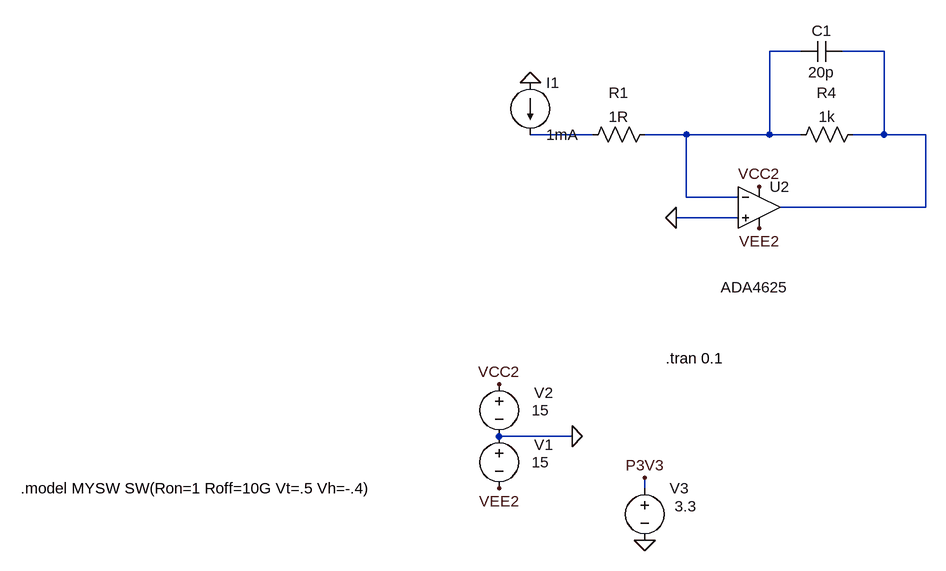
[diagram p0: schematic Draft20.asc]
Draft20.asc, the LTspice schematic file:
Version 4
SHEET 1 1768 872
WIRE 480 -112 432 -112
WIRE 608 -112 544 -112
WIRE 160 16 64 16
WIRE 304 16 240 16
WIRE 432 16 432 -112
WIRE 432 16 304 16
WIRE 480 16 432 16
WIRE 608 16 608 -112
WIRE 608 16 560 16
WIRE 672 16 608 16
WIRE 304 112 304 16
WIRE 384 112 304 112
WIRE 672 128 672 16
WIRE 672 128 448 128
WIRE 384 144 288 144
WIRE 128 480 16 480
WIRE 240 560 240 544
FLAG 128 480 0
FLAG 16 560 VEE2
FLAG 16 400 VCC2
FLAG 416 160 VEE2
FLAG 416 96 VCC2
FLAG 240 640 0
FLAG 240 544 P3V3
FLAG 64 -64 0
FLAG 288 144 0
SYMBOL voltage 16 464 R0
WINDOW 0 54 29 Left 2
WINDOW 3 50 56 Left 2
WINDOW 123 0 0 Left 0
WINDOW 39 0 0 Left 0
SYMATTR InstName V1
SYMATTR Value 15
SYMBOL voltage 16 384 R0
WINDOW 0 54 29 Left 2
WINDOW 3 50 56 Left 2
WINDOW 123 0 0 Left 0
WINDOW 39 0 0 Left 0
SYMATTR InstName V2
SYMATTR Value 15
SYMBOL res 576 0 R90
WINDOW 0 -33 56 VBottom 2
WINDOW 3 -27 56 VTop 2
SYMATTR InstName R4
SYMATTR Value 1k
SYMBOL OpAmps\\ADA4625 416 64 R0
WINDOW 3 -59 187 Left 2
SYMATTR InstName U2
SYMBOL voltage 240 544 R0
WINDOW 123 0 0 Left 0
WINDOW 39 0 0 Left 0
WINDOW 3 46 44 Left 2
WINDOW 0 38 16 Left 2
SYMATTR Value 3.3
SYMATTR InstName V3
SYMBOL current 64 -64 R0
WINDOW 123 0 0 Left 0
WINDOW 39 0 0 Left 0
SYMATTR InstName I1
SYMATTR Value 1mA
SYMBOL res 256 0 R90
WINDOW 0 -33 56 VBottom 2
WINDOW 3 -27 56 VTop 2
SYMATTR InstName R1
SYMATTR Value 1R
SYMBOL cap 544 -128 R90
WINDOW 0 0 32 VBottom 2
WINDOW 3 32 32 VTop 2
SYMATTR InstName C1
SYMATTR Value 20p
TEXT 272 360 Left 2 !.tran 0.1
TEXT -720 560 Left 2 !.model MYSW SW(Ron=1 Roff=10G Vt=.5 Vh=-.4)

The netlist it stands for:
* Draft20.asc
V1 0 VEE2 15
V2 VCC2 0 15
R4 N002 N001 1k
XU2 0 N001 VCC2 VEE2 N002 ADA4625  ; pins In+ In- V+ V- OUT
V3 P3V3 0 3.3
I1 0 N003 1mA
R1 N001 N003 1R
C1 N002 N001 20p
.tran 0.1
.model MYSW SW(Ron=1 Roff=10G Vt=.5 Vh=-.4)
.backanno
.end